# Altium schematic sheet LAN.SchDoc
size 593 x 419 mm; SheetNumber: 3; SheetTotal: 3
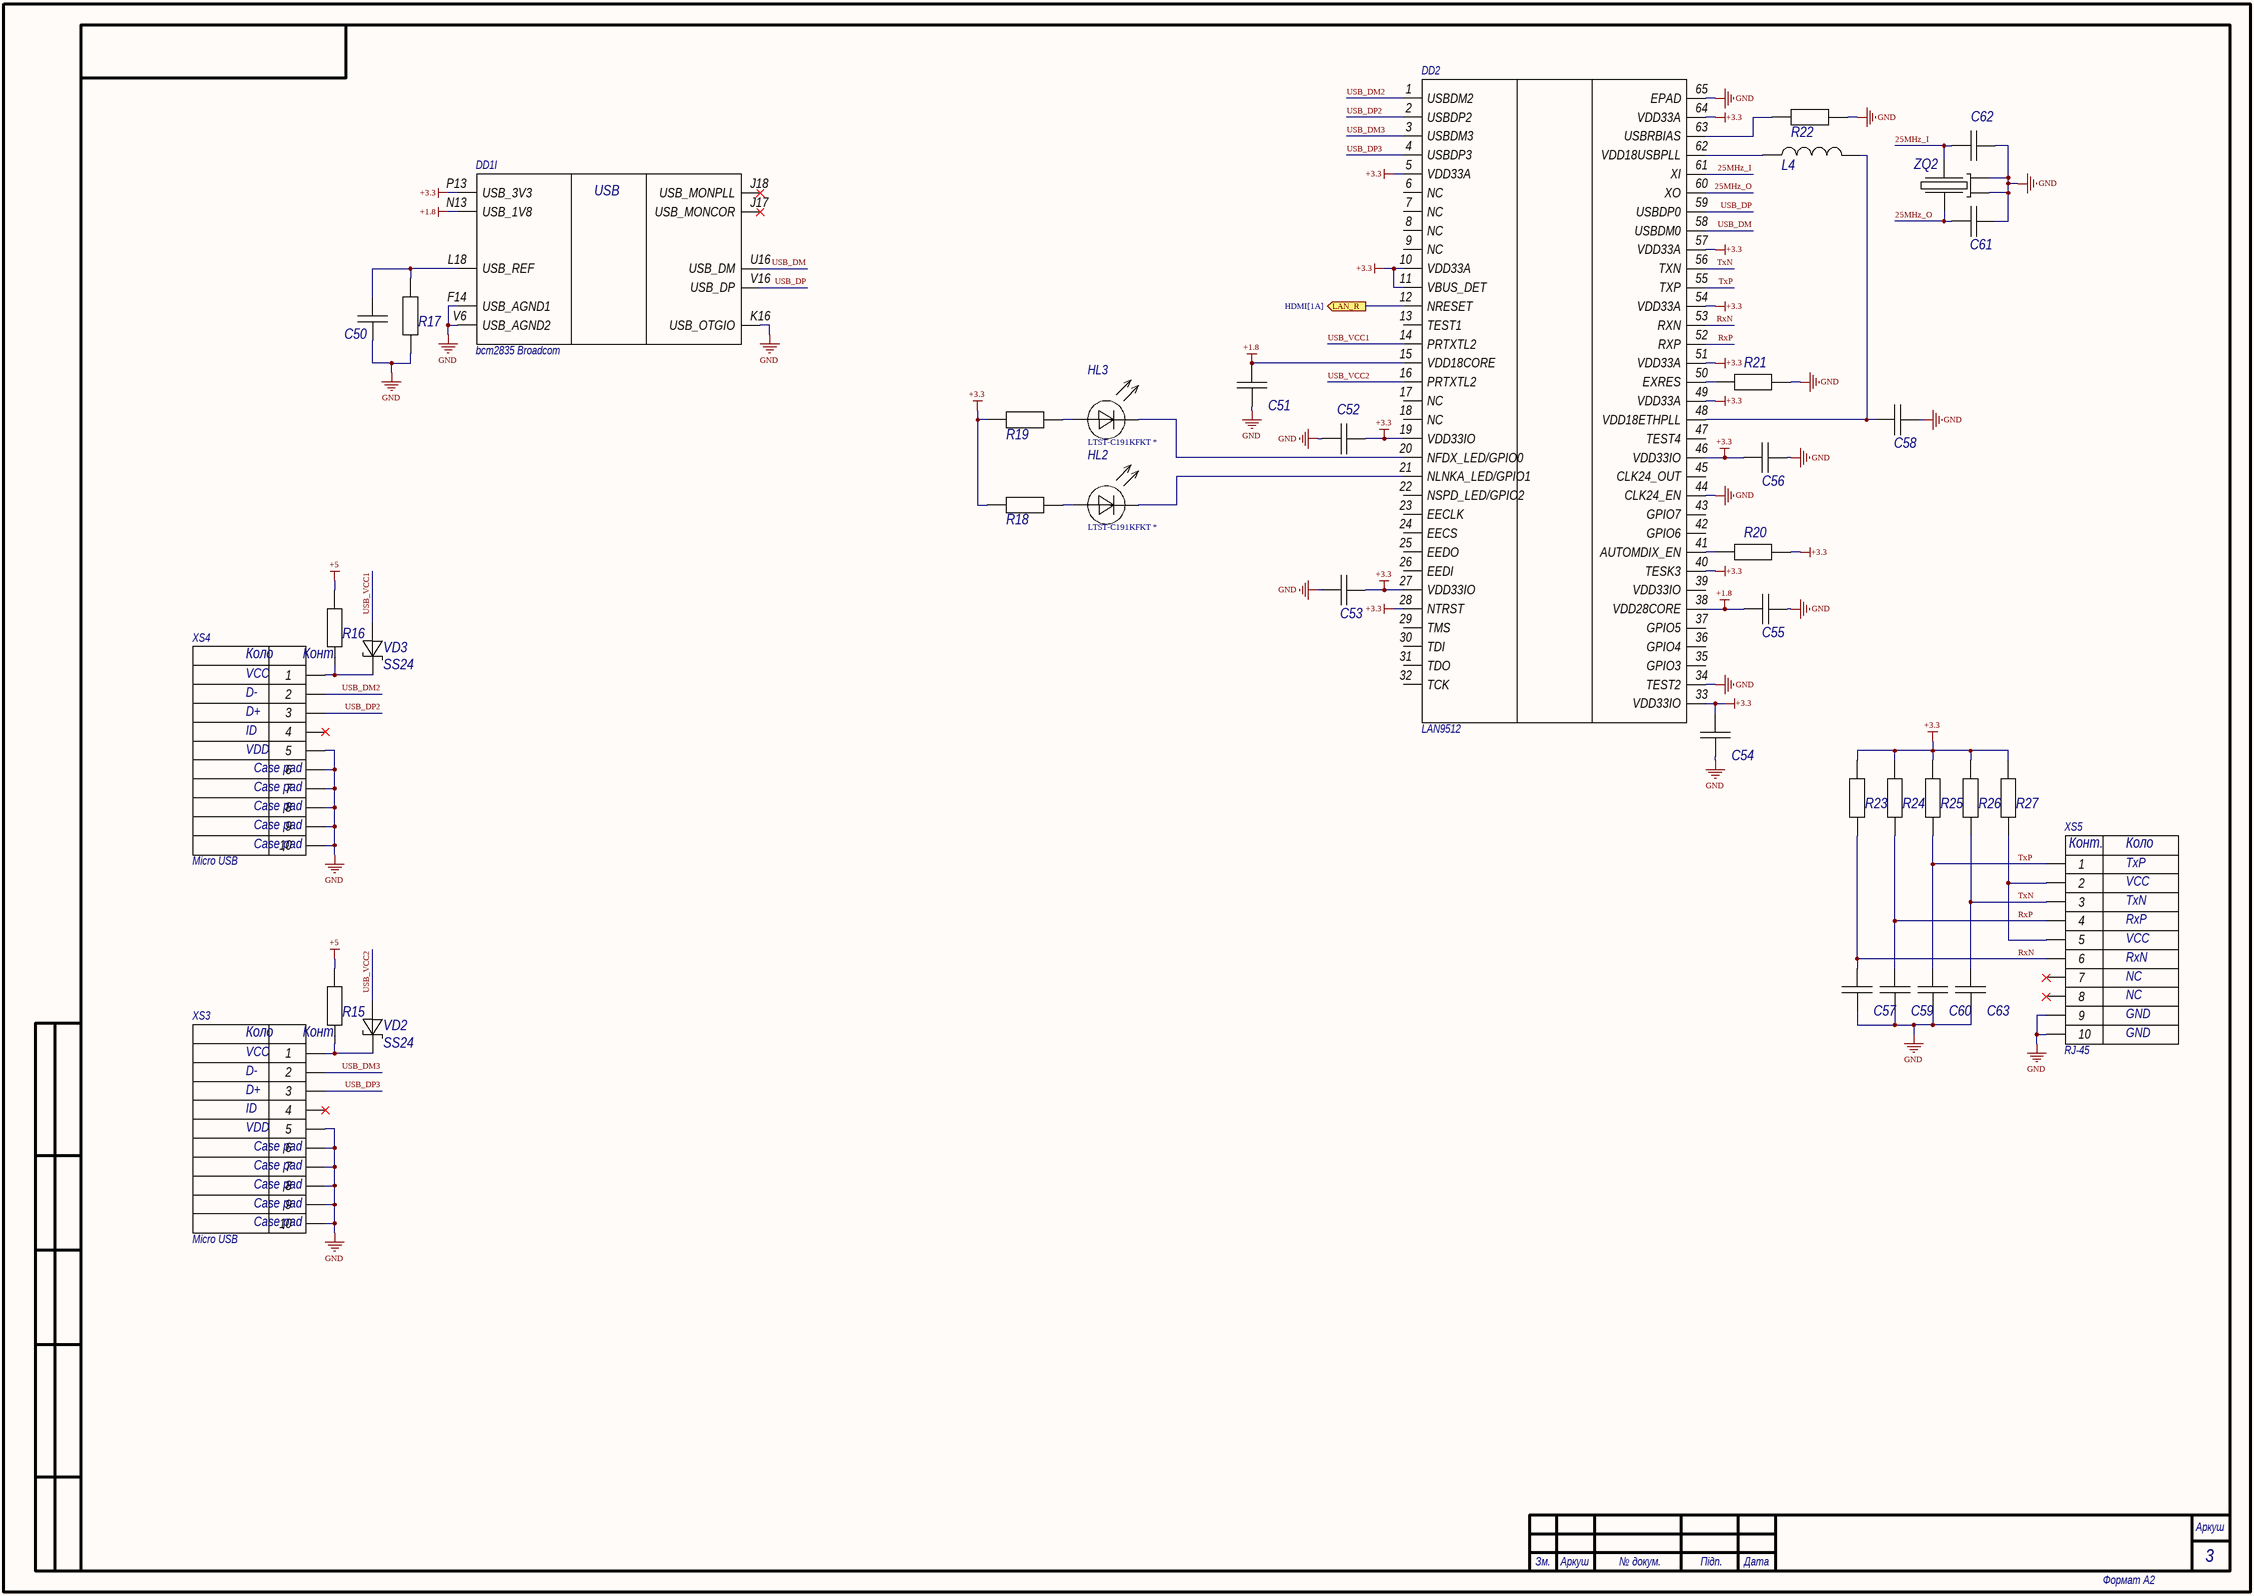
[diagram p0: LAN.SchDoc]

## Parts
C50  C-0603 * * * * *  [С-0603]  (value not drawn)
C51  C-0402 * * * * *  [C-0402]  (value not drawn)
C52  C-0402 * * * * *  [C-0402]  (value not drawn)
C53  C-0402 * * * * *  [C-0402]  (value not drawn)
C54  C-0402 * * * * *  [C-0402]  (value not drawn)
C55  C-0402 * * * * *  [C-0402]  (value not drawn)
C56  C-0402 * * * * *  [C-0402]  (value not drawn)
C57  C-0603 * * * * *  [С-0603]  (value not drawn)
C58  C-0402 * * * * *  [C-0402]  (value not drawn)
C59  C-0603 * * * * *  [С-0603]  (value not drawn)
C60  C-0603 * * * * *  [С-0603]  (value not drawn)
C61  C-0402 * * * * *  [C-0402]  (value not drawn)
C62  C-0402 * * * * *  [C-0402]  (value not drawn)
C63  C-0603 * * * * *  [С-0603]  (value not drawn)
DD1  bcm2835 Broadcom  [BGA81C65P18X18_1200X1200]  (part I of 16)
DD2  LAN9512  [QFN64_9x9MC_MCH]
HL2  LTST-C191KFKT *  [LED_DIALIGHT_598_DIA]
HL3  LTST-C191KFKT *  [LED_DIALIGHT_598_DIA]
L4  R-0402 * * * *  [FB-0805]  (value not drawn)
R15  R-0603 * * * *  [R-0603]  (value not drawn)
R16  R-0603 * * * *  [R-0603]  (value not drawn)
R17  R-0603 * * * *  [R-0603]  (value not drawn)
R18  R-0603 * * * *  [R-0603]  (value not drawn)
R19  R-0603 * * * *  [R-0603]  (value not drawn)
R20  R-0402 * * * *  [R-0402]  (value not drawn)
R21  R-0402 * * * *  [R-0402]  (value not drawn)
R22  R-0402 * * * *  [R-0402]  (value not drawn)
R23  R-0603 * * * *  [R-0603]  (value not drawn)
R24  R-0603 * * * *  [R-0603]  (value not drawn)
R25  R-0603 * * * *  [R-0603]  (value not drawn)
R26  R-0603 * * * *  [R-0603]  (value not drawn)
R27  R-0603 * * * *  [R-0603]  (value not drawn)
VD2  SS24 *  [SS14]  (value not drawn)
VD3  SS24 *  [SS14]  (value not drawn)
XS3  Micro USB  [micro-usb]
XS4  Micro USB  [micro-usb]
XS5  RJ-45  [CONN8_2041126-1_TEC]
ZQ2  TXC19.2 *  [CRYSTAL_TXC_7B]  (value not drawn)

## Ports
LAN_R (out, see HDMI[1A])

## Nets
+1.8: C51.2 C55.2 DD1.N13(USB_1V8) DD2.15(VDD18CORE) DD2.38(VDD28CORE)
+3.3: C52.2 C53.2 C54.2 C56.2 DD1.P13(USB_3V3) DD2.5(VDD33A) DD2.10(VDD33A) DD2.11(VBUS_DET) DD2.19(VDD33IO) DD2.27(VDD33IO) DD2.28(NTRST) DD2.33(VDD33IO) DD2.40(TESK3) DD2.46(VDD33IO) DD2.49(VDD33A) DD2.51(VDD33A) DD2.54(VDD33A) DD2.57(VDD33A) DD2.64(VDD33A) R18.1 R19.1 R20.2 R23.1 R24.1 R25.1 R26.1 R27.1
+5: R15.2 R16.2
GND: C50.1 C51.1 C52.1 C53.1 C54.1 C55.1 C56.1 C57.2 C58.1 C59.2 C60.2 C61.2 C62.2 C63.2 DD1.F14(USB_AGND1) DD1.K16(USB_OTGIO) DD1.V6(USB_AGND2) DD2.34(TEST2) DD2.44(CLK24_EN) DD2.65(EPAD) R17.1 R21.2 R22.2 XS3.5 XS3.6 XS3.7 XS3.8 XS3.9 XS3.10 XS4.5 XS4.6 XS4.7 XS4.8 XS4.9 XS4.10 XS5.9 XS5.10 ZQ2.2 ZQ2.4
25MHz_I: C62.1 DD2.61(XI) ZQ2.3
25MHz_O: C61.1 DD2.60(XO) ZQ2.1
LAN_R: DD2.12(NRESET) ; port LAN_R
RxN: C57.1 DD2.53(RXN) R23.2 XS5.6
RxP: C59.1 DD2.52(RXP) R24.2 XS5.4
TxN: C63.1 DD2.56(TXN) R26.2 XS5.3
TxP: C60.1 DD2.55(TXP) R25.2 XS5.1
USB_DM: DD1.U16(USB_DM) DD2.58(USBDM0)
USB_DM2: DD2.1(USBDM2) XS4.2
USB_DM3: DD2.3(USBDM3) XS3.2
USB_DP: DD1.V16(USB_DP) DD2.59(USBDP0)
USB_DP2: DD2.2(USBDP2) XS4.3
USB_DP3: DD2.4(USBDP3) XS3.3
USB_VCC1: DD2.14(PRTXTL2) VD3.1
USB_VCC2: DD2.16(PRTXTL2) VD2.1
NetC50_2: C50.2 DD1.L18(USB_REF) R17.2
NetC58_2: C58.2 DD2.48(VDD18ETHPLL) L4.2
NetDD2_20: DD2.20(NFDX_LED/GPIO0) HL3.2
NetDD2_21: DD2.21(NLNKA_LED/GPIO1) HL2.2
NetDD2_41: DD2.41(AUTOMDIX_EN) R20.1
NetDD2_50: DD2.50(EXRES) R21.1
NetDD2_62: DD2.62(VDD18USBPLL) L4.1
NetDD2_63: DD2.63(USBRBIAS) R22.1
NetHL2_1: HL2.1 R18.2
NetHL3_1: HL3.1 R19.2
NetR15_1: R15.1 VD2.2 XS3.1
NetR16_1: R16.1 VD3.2 XS4.1
NetR27_2: R27.2 XS5.2 XS5.5

Not connected (* = marked no-connect by the designer): DD1 J17(USB_MONCOR)* J18(USB_MONPLL)*; DD2 6(NC) 7(NC) 8(NC) 9(NC) 13(TEST1) 17(NC) 18(NC) 22(NSPD_LED/GPIO2) 23(EECLK) 24(EECS) 25(EEDO) 26(EEDI) 29(TMS) 30(TDI) 31(TDO) 32(TCK) 35(GPIO3) 36(GPIO4) 37(GPIO5) 39(VDD33IO) 42(GPIO6) 43(GPIO7) 45(CLK24_OUT) 47(TEST4); XS3 4*; XS4 4*; XS5 7* 8*

## Notes on the sheet
- Аркуш
- Зм.
- № докум.
- Підп.
- Дата
- Формат А2
- (in symbol bcm2835, part I) USB
- (in symbol Micro-USB) Коло; Конт.; VCC; D-; D+; ID; VDD; Case pad
- (in symbol RJ-45) Конт.; Коло; TxP; VCC; TxN; RxP; RxN; NC; GND

## Library data of the parts
C50 C57 C59 C60 C63 = С-0603: Generic; Manufacturer: *; Tolerance: *; Package: C-0603; Temp_Coef: *; Voltage: *; Value: *
C51-C56 C58 C61 C62 = С-0402: Generic; Manufacturer: *; Tolerance: *; Package: C-0402; Temp_Coef: *; Voltage: *; Value: *
DD1 = bcm2835: BCM2835 ARM-based processor; Manufacturer: Broadcom; Name: bcm2835
DD2 = LAN9512: Ethernet + USB Controller; Name: LAN9512
HL2 HL3 = LED 0603: Generic LED 0603; Manufacturer: *; Name: LTST-C191KFKT
L4 = Ferrite Bead 0805: Generic; Manufacturer: *; Tolerance: *; Package: R-0402; Power: *; Value: *
R15-R19 R23-R27 = R-0603: Generic; Manufacturer: *; Tolerance: *; Package: R-0603; Power: *; Value: *
R20-R22 = R-0402: Generic; Manufacturer: *; Tolerance: *; Package: R-0402; Power: *; Value: *
VD2 VD3 = SS24: SS24 Shotky; Manufacturer: *; Name: SS24
XS3 XS4 = Micro-USB: Micro-USB connector for SMT mounting; Name: kls1-tf
XS5 = RJ-45: RJ-45 connector SMT mounting; Name: kls1-tf
ZQ2 = TXC19.2: TXC19.2 crystal 19.2 MHz; Manufacturer: *; Value: *; Name: TXC19.2